# Altium schematic sheet Active_filter.SchDoc
size A
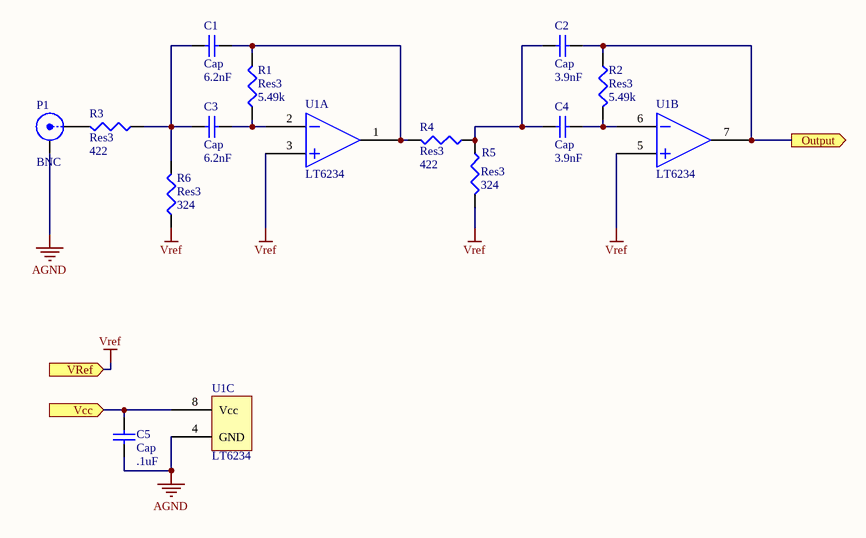
[diagram p0: Active_filter.SchDoc]

## Parts
C1  Cap  value 6.2nF  [1608[0603]]
C2  Cap  value 3.9nF  [1608[0603]]
C3  Cap  value 6.2nF  [1608[0603]]
C4  Cap  value 3.9nF  [1608[0603]]
C5  Cap  value .1uF  [1608[0603]]
P1  BNC  [BNC_RA CON]
R1  Res3  value 5.49k  [1608[0603]]
R2  Res3  value 5.49k  [J1-0603]
R3  Res3  value 422  [1608[0603]]
R4  Res3  value 422  [J1-0603]
R5  Res3  value 324  [J1-0603]
R6  Res3  value 324  [1608[0603]]
U1  LT6234  [SOIC127P600X150-8N(LT6233)]  (parts A,B,C of 3)

## Ports
Output (out), Vcc (in), VRef (in)

## Nets
AGND: C5.1 P1.2(Y) U1.4(GND)
Vref: R5.2 R6.1 U1.3(+IN_A) U1.5(+IN_B) ; port VRef
Output: C2.2 R2.1 U1.7(OUT_B) ; port Output
Vcc: C5.2 U1.8(Vcc) ; port Vcc
NetC1_1: C1.1 C3.1 R3.1 R6.2
NetC1_2: C1.2 R1.2 R4.2 U1.1(OUT_A)
NetC2_1: C2.1 C4.2 R4.1 R5.1
NetC3_2: C3.2 R1.1 U1.2(-IN_A)
NetC4_1: C4.1 R2.2 U1.6(-IN_B)
NetP1_1: P1.1(X) R3.2

## Library data of the parts
C1-C5 = Cap: Capacitor; Published: 8-Jun-2000; LatestRevisionDate: 17-Jul-2002; LatestRevisionNote: Re-released for DXP Platform.; PackageReference: RAD-0.3; Publisher: Altium Limited; PackageDescription: Radial Cap, Thru-Hole; 2 Leads; 0.3 in Pin Spacing
P1 = BNC: BNC Elbow Connector; LatestRevisionDate: 17-Jul-2002; LatestRevisionNote: Re-released for DXP Platform.; Publisher: Altium Limited
R1-R6 = Res3: Resistor; Published: 8-Jun-2000; LatestRevisionDate: 29-May-2009; LatestRevisionNote: IPC-7351 Footprint Added.; PackageReference: J1-0603; Publisher: Altium Limited; PackageDescription: Chip Resistor